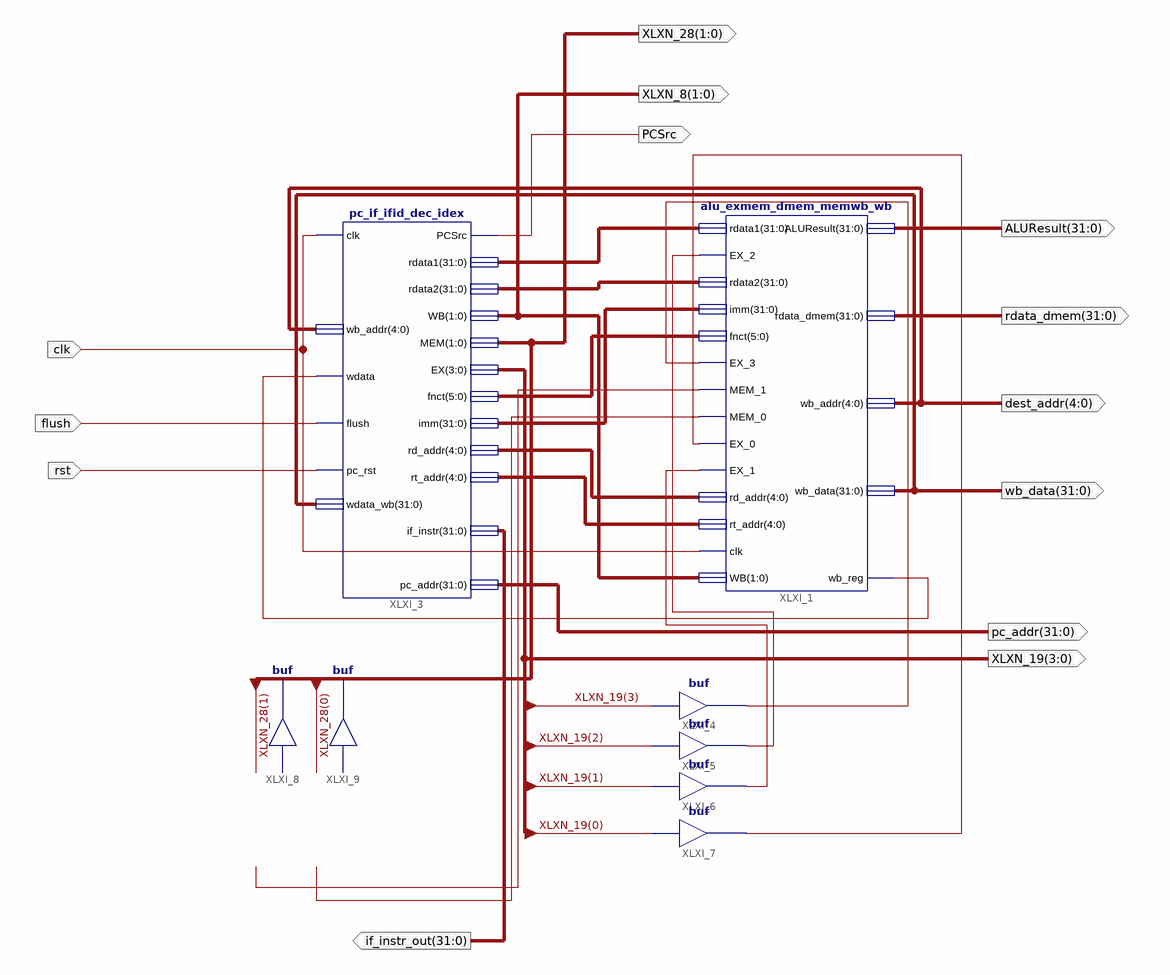
[diagram p0: schematic sheet 1]
// Xilinx ISE schematic cpu.sch (spartan3a) as structural Verilog: 8 symbols, 13 ports
module cpu (
  input  clk,
  input  flush,
  input  rst,
  output [1:0] XLXN_8,
  output [4:0] dest_addr,
  output [31:0] wb_data,
  output [31:0] rdata_dmem,
  output [31:0] ALUResult,
  output PCSrc,
  output [3:0] XLXN_19,
  output [1:0] XLXN_28,
  output [31:0] if_instr_out,
  output [31:0] pc_addr
);

  wire XLXN_13, XLXN_24, XLXN_25, XLXN_26, XLXN_27, XLXN_31, XLXN_32;
  wire [4:0] XLXN_9, XLXN_10;
  wire [5:0] XLXN_15;
  wire [31:0] XLXN_6, XLXN_7, XLXN_14;

  alu_exmem_dmem_memwb_wb XLXI_1 (
    .rdata1(XLXN_6), .EX_2(XLXN_25), .rdata2(XLXN_7), .imm(XLXN_14), .fnct(XLXN_15), .EX_3(XLXN_24),
    .MEM_1(XLXN_31), .MEM_0(XLXN_32), .EX_0(XLXN_27), .EX_1(XLXN_26), .rd_addr(XLXN_9), .rt_addr(XLXN_10),
    .clk(clk), .WB(XLXN_8), .ALUResult(ALUResult), .rdata_dmem(rdata_dmem), .wb_addr(dest_addr),
    .wb_data(wb_data), .wb_reg(XLXN_13));
  pc_if_ifid_dec_idex XLXI_3 (
    .clk(clk), .wdata_wb(wb_data), .wb_addr(dest_addr), .wdata(XLXN_13), .flush(flush), .pc_rst(rst),
    .pc_addr(pc_addr), .if_instr(if_instr_out), .PCSrc(PCSrc), .rdata1(XLXN_6), .rdata2(XLXN_7), .WB(XLXN_8),
    .MEM(XLXN_28), .EX(XLXN_19), .fnct(XLXN_15), .imm(XLXN_14), .rd_addr(XLXN_9), .rt_addr(XLXN_10));
  buf XLXI_4 (XLXN_24, XLXN_19[3]);
  buf XLXI_5 (XLXN_25, XLXN_19[2]);
  buf XLXI_6 (XLXN_26, XLXN_19[1]);
  buf XLXI_7 (XLXN_27, XLXN_19[0]);
  buf XLXI_8 (XLXN_31, XLXN_28[1]);
  buf XLXI_9 (XLXN_32, XLXN_28[0]);
endmodule
